# EAGLE design Postmaster (EAGLE 6.3)
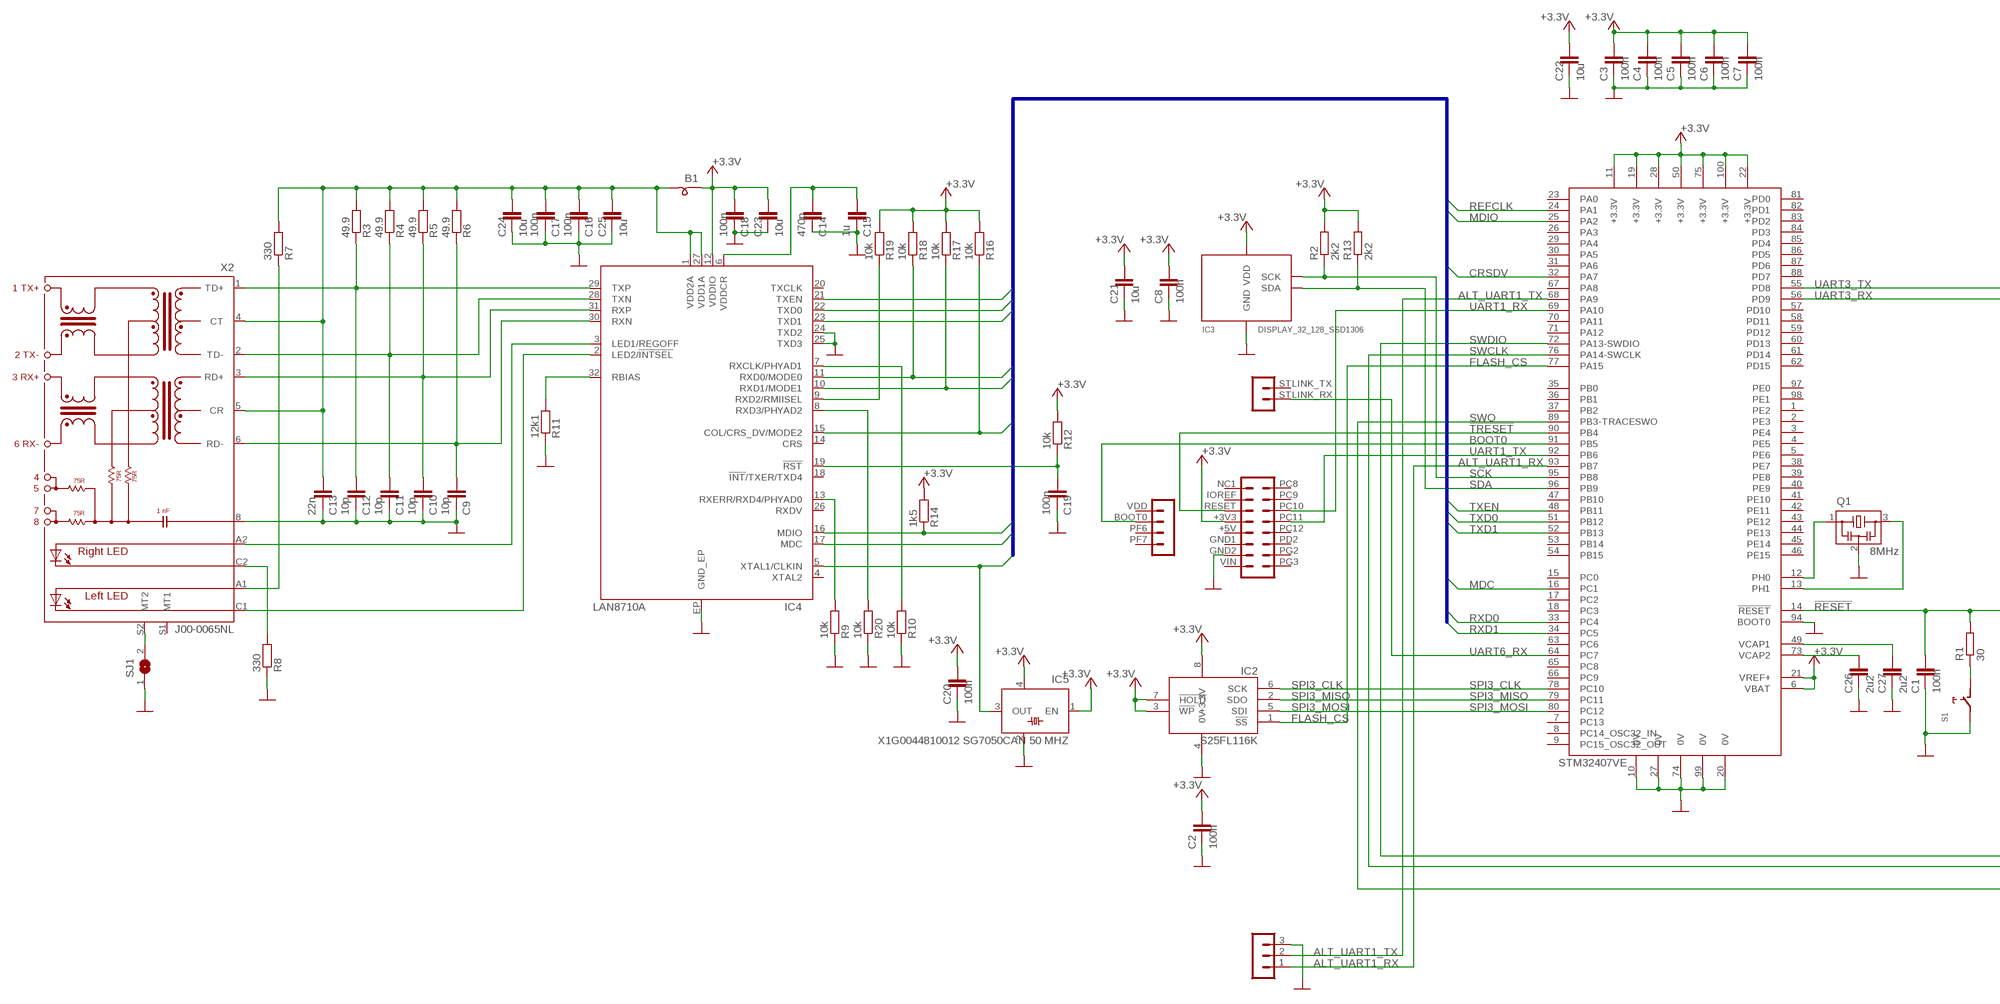
[diagram p0: schematic, sheet 1, part 1 of 2]
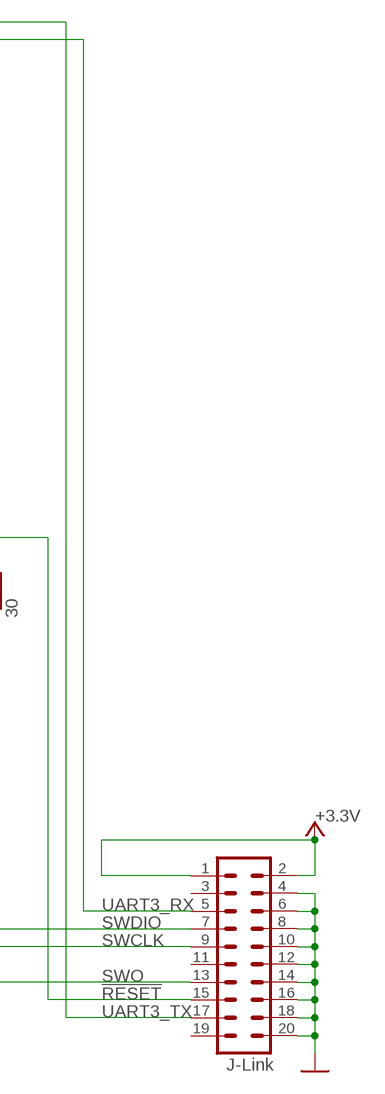
[diagram p1: schematic, sheet 1, part 2 of 2]

## Parts
B1  BEADSMD  [0805]
C1  100n  CAPACITOR0805  [0805]
C2  100n  CAPACITOR0805  [0805]
C3  100n  CAPACITOR0805  [0805]
C4  100n  CAPACITOR0805  [0805]
C5  100n  CAPACITOR0805  [0805]
C6  100n  CAPACITOR0805  [0805]
C7  100n  CAPACITOR0805  [0805]
C8  100n  CAPACITOR0805  [0805]
C9  10p  CAPACITOR0805  [0805]
C10  10p  CAPACITOR0805  [0805]
C11  10p  CAPACITOR0805  [0805]
C12  10p  CAPACITOR0805  [0805]
C13  22n  CAPACITOR0805  [0805]
C14  470p  CAPACITOR0805  [0805]
C15  1u  CAPACITOR0805  [0805]
C16  100n  CAPACITOR0805  [0805]
C17  100n  CAPACITOR0805  [0805]
C18  100n  CAPACITOR0805  [0805]
C19  100n  CAPACITOR0805  [0805]
C20  100n  CAPACITOR0805  [0805]
C21  10u  CAPACITOR0805  [0805]
C22  10u  CAPACITOR0805  [0805]
C23  10u  CAPACITOR0805  [0805]
C24  10u  CAPACITOR0805  [0805]
C25  10u  CAPACITOR0805  [0805]
C26  2u2  CAPACITOR0805  [0805]
C27  2u2  CAPACITOR0805  [0805]
IC1  STM32F407  [TQFP100]
IC2  S25FL116K  S25FL116KW  [SOIC8-WIDE]
IC3  DISPLAY_32_128_SSD1306  [DISPLAY_128_32_SSD1306]
IC4  LAN8710A  [QFN32]
IC5  X1G0044810012 SG7050CAN 50 MHZ  SM77H  [SM77H]
Q1  8MHz  RESONATOR-S  [RESONATOR-SMALL]
R1  30  RESISTORR0805  [0805]
R2  2k2  RESISTORR0805  [0805]
R3  49.9  RESISTORR0805  [0805]
R4  49.9  RESISTORR0805  [0805]
R5  49.9  RESISTORR0805  [0805]
R6  49.9  RESISTORR0805  [0805]
R7  330  RESISTORR0805  [0805]
R8  330  RESISTORR0805  [0805]
R9  10k  RESISTORR0805  [0805]
R10  10k  RESISTORR0805  [0805]
R11  12k1  RESISTORR0805  [0805]
R12  10k  RESISTORR0805  [0805]
R13  2k2  RESISTORR0805  [0805]
R14  1k5  RESISTORR0805  [0805]
R16  10k  RESISTORR0805  [0805]
R17  10k  RESISTORR0805  [0805]
R18  10k  RESISTORR0805  [0805]
R19  10k  RESISTORR0805  [0805]
R20  10k  RESISTORR0805  [0805]
S1  SWITCHSMD  [SWITCH-SMD]
SJ1  SJ  [SJ]
U$1  NUCLEO-TOPLEFT  [NUCLEO-TOPLEFT]
U$3  HEADER-MALE-3  [HEADER-MALE-3]
X1  HEADER-IDC-10-2  [IDC-10_2]
X2  J00-0065NL  [ETHERNET]

## Nets
0V: C1.2 C2.2 C3.2 C4.2 C5.2 C6.2 C7.2 C8.2 C9.2 C10.2 C11.2 C12.2 C13.2 C14.2 C15.2 C16.2 C17.2 C18.2 C19.2 C20.2 C21.2 C22.2 C23.2 C24.2 C25.2 C26.2 C27.2 IC1.10(0V) IC1.20(0V) IC1.27(0V) IC1.74(0V) IC1.94(BOOT0) IC1.99(0V) IC2.4(0V) IC3.GND IC4.24(TXD2) IC4.25(TXD3) IC4.EP(GND_EP) IC5.2(0V) Q1.2 R8.1 R9.1 R10.1 R11.1 R20.1 S1.3 S1.4 SJ1.1 U$1.GND2 U$3.3 X1.4 X1.6 X1.8 X1.10 X1.12 X1.14 X1.16 X1.18 X1.20 X2.8
!RESET!: C1.1 IC1.14(!RESET!) R1.2 X1.15
!TRESET!: IC1.90(PB4) U$1.RESET
+3.3V: B1.1 C2.1 C3.1 C4.1 C5.1 C6.1 C7.1 C8.1 C18.1 C20.1 C21.1 C22.1 C23.1 IC1.6(VBAT) IC1.11(+3.3V) IC1.19(+3.3V) IC1.21(VREF+) IC1.22(+3.3V) IC1.28(+3.3V) IC1.50(+3.3V) IC1.75(+3.3V) IC1.100(+3.3V) IC2.3(!WP!) IC2.7(!HOLD!) IC2.8(+3.3V) IC3.VCC(VDD) IC4.12(VDDIO) IC5.1(EN) IC5.4(+3.3V) R2.2 R12.2 R13.2 R14.2 R16.2 R17.2 R18.2 R19.2 U$1.+3V3 X1.1 X1.2
ALT_UART1_RX: IC1.93(PB7) U$3.1
ALT_UART1_TX: IC1.68(PA9) U$3.2
BOOT0: IC1.91(PB5) U$1.BOOT0
CRSDV: IC1.32(PA7) IC4.15(COL/CRS_DV/MODE2) R16.1
FLASH_CS: IC1.77(PA15) IC2.1(!SS!)
MDC: IC1.16(PC1) IC4.17(MDC)
MDIO: IC1.25(PA2) IC4.16(MDIO) R14.1
N$1: C26.1 IC1.73(VCAP2)
N$2: R1.1 S1.1 S1.2
N$3: C27.1 IC1.49(VCAP1)
N$4: R7.1 X2.A1(A-L)
N$5: IC4.3(LED1/REGOFF) X2.A2(A-R)
N$6: R8.2 X2.C2(C-R)
N$8: IC1.12(PH0) Q1.1
N$9: IC1.13(PH1) Q1.3
N$21: C12.1 IC4.29(TXP) R3.1 X2.1(TD+)
N$22: C11.1 IC4.28(TXN) R4.1 X2.2(TD-)
N$23: C10.1 IC4.31(RXP) R5.1 X2.3(RD+)
N$24: C9.1 IC4.30(RXN) R6.1 X2.6(RD-)
N$27: IC4.2(LED2/!INTSEL!) X2.C1(C-L)
N$31: IC4.13(RXERR/RXD4/PHYAD0) R9.2
N$32: IC4.7(RXCLK/PHYAD1) R10.2
N$33: IC4.32(RBIAS) R11.2
N$34: C14.1 C15.1 IC4.6(VDDCR)
N$35: SJ1.2 X2.S2(MT2)
N$36: B1.2 C13.1 C16.1 C17.1 C24.1 C25.1 IC4.1(VDD2A) IC4.27(VDD1A) R3.2 R4.2 R5.2 R6.2 R7.2 X2.4(CT) X2.5(CR)
N$42: C19.1 IC4.19(!RST!) R12.1
N$45: IC4.8(RXD3/PHYAD2) R20.2
N$47: IC4.9(RXD2/RMIISEL) R19.1
REFCLK: IC1.24(PA1) IC4.5(XTAL1/CLKIN) IC5.3(OUT)
RXD0: IC1.33(PC4) IC4.11(RXD0/MODE0) R18.1
RXD1: IC1.34(PC5) IC4.10(RXD1/MODE1) R17.1
SCK: IC1.95(PB8) IC3.SCK R2.1
SDA: IC1.96(PB9) IC3.SDA R13.1
SPI3_CLK: IC1.78(PC10) IC2.6(SCK)
SPI3_MISO: IC1.79(PC11) IC2.2(SDO)
SPI3_MOSI: IC1.80(PC12) IC2.5(SDI)
SWCLK: IC1.76(PA14-SWCLK) X1.9
SWDIO: IC1.72(PA13-SWDIO) X1.7
SWO: IC1.89(PB3-TRACESWO) X1.13
TXD0: IC1.51(PB12) IC4.22(TXD0)
TXD1: IC1.52(PB13) IC4.23(TXD1)
TXEN: IC1.48(PB11) IC4.21(TXEN)
UART1_RX: IC1.69(PA10) U$1.PC10
UART1_TX: IC1.92(PB6) U$1.PC11
UART3_RX: IC1.56(PD9) X1.5
UART3_TX: IC1.55(PD8) X1.17
UART6_RX: IC1.64(PC7) U$1.STLINK_RX
Unconnected: IC1.1(PE2) IC1.2(PE3) IC1.3(PE4) IC1.4(PE5) IC1.5(PE6) IC1.7(PC13) IC1.8(PC14_OSC32_IN) IC1.9(PC15_OSC32_OUT) IC1.15(PC0) IC1.17(PC2) IC1.18(PC3) IC1.23(PA0) IC1.26(PA3) IC1.29(PA4) IC1.30(PA5) IC1.31(PA6) IC1.35(PB0) IC1.36(PB1) IC1.37(PB2) IC1.38(PE7) IC1.39(PE8) IC1.40(PE9) IC1.41(PE10) IC1.42(PE11) IC1.43(PE12) IC1.44(PE13) IC1.45(PE14) IC1.46(PE15) IC1.47(PB10) IC1.53(PB14) IC1.54(PB15) IC1.57(PD10) IC1.58(PD11) IC1.59(PD12) IC1.60(PD13) IC1.61(PD14) IC1.62(PD15) IC1.63(PC6) IC1.65(PC8) IC1.66(PC9) IC1.67(PA8) IC1.70(PA11) IC1.71(PA12) IC1.81(PD0) IC1.82(PD1) IC1.83(PD2) IC1.84(PD3) IC1.85(PD4) IC1.86(PD5) IC1.87(PD6) IC1.88(PD7) IC1.97(PE0) IC1.98(PE1) IC4.4(XTAL2) IC4.14(CRS) IC4.18(!INT!/TXER/TXD4) IC4.20(TXCLK) IC4.26(RXDV) U$1.+5V U$1.GND1 U$1.IOREF U$1.NC1 U$1.PC8 U$1.PC9 U$1.PC12 U$1.PD2 U$1.PF6 U$1.PF7 U$1.PG2 U$1.PG3 U$1.STLINK_TX U$1.VDD U$1.VIN X1.3 X1.11 X1.19 X2.S1(MT1)

## Buses
MDIO,MDC,REFCLK,CRSDV,RXD0,RXD1,TXEN,TXD0,TXD1

## Notes on the sheet
- STM32407VE
- J-Link

## Library data of the parts
B1 = passive:BEAD
C1-C27 = passive:CAPACITOR
IC1 = ic:STM32F407
IC2 = ic:S25FL116K
IC3 = ic:DISPLAY_32_128_SSD1306
IC4 = ic:LAN8710A
IC5 = ic:SM77H: 3.3V CMOS Clock Oscillator Source: www.pletronics.com .. sm77h%203.3v.pdf
Q1 = passive:RESONATOR
R1-R14 R16-R20 = passive:RESISTOR
S1 = passive:SWITCH
SJ1 = jumper:SJ: SMD solder JUMPER
U$1 = header:NUCLEO-TOPLEFT
U$3 = header:HEADER-MALE-3
X1 = header:HEADER-IDC-10-2
X2 = header:J00-0065NL

## Board
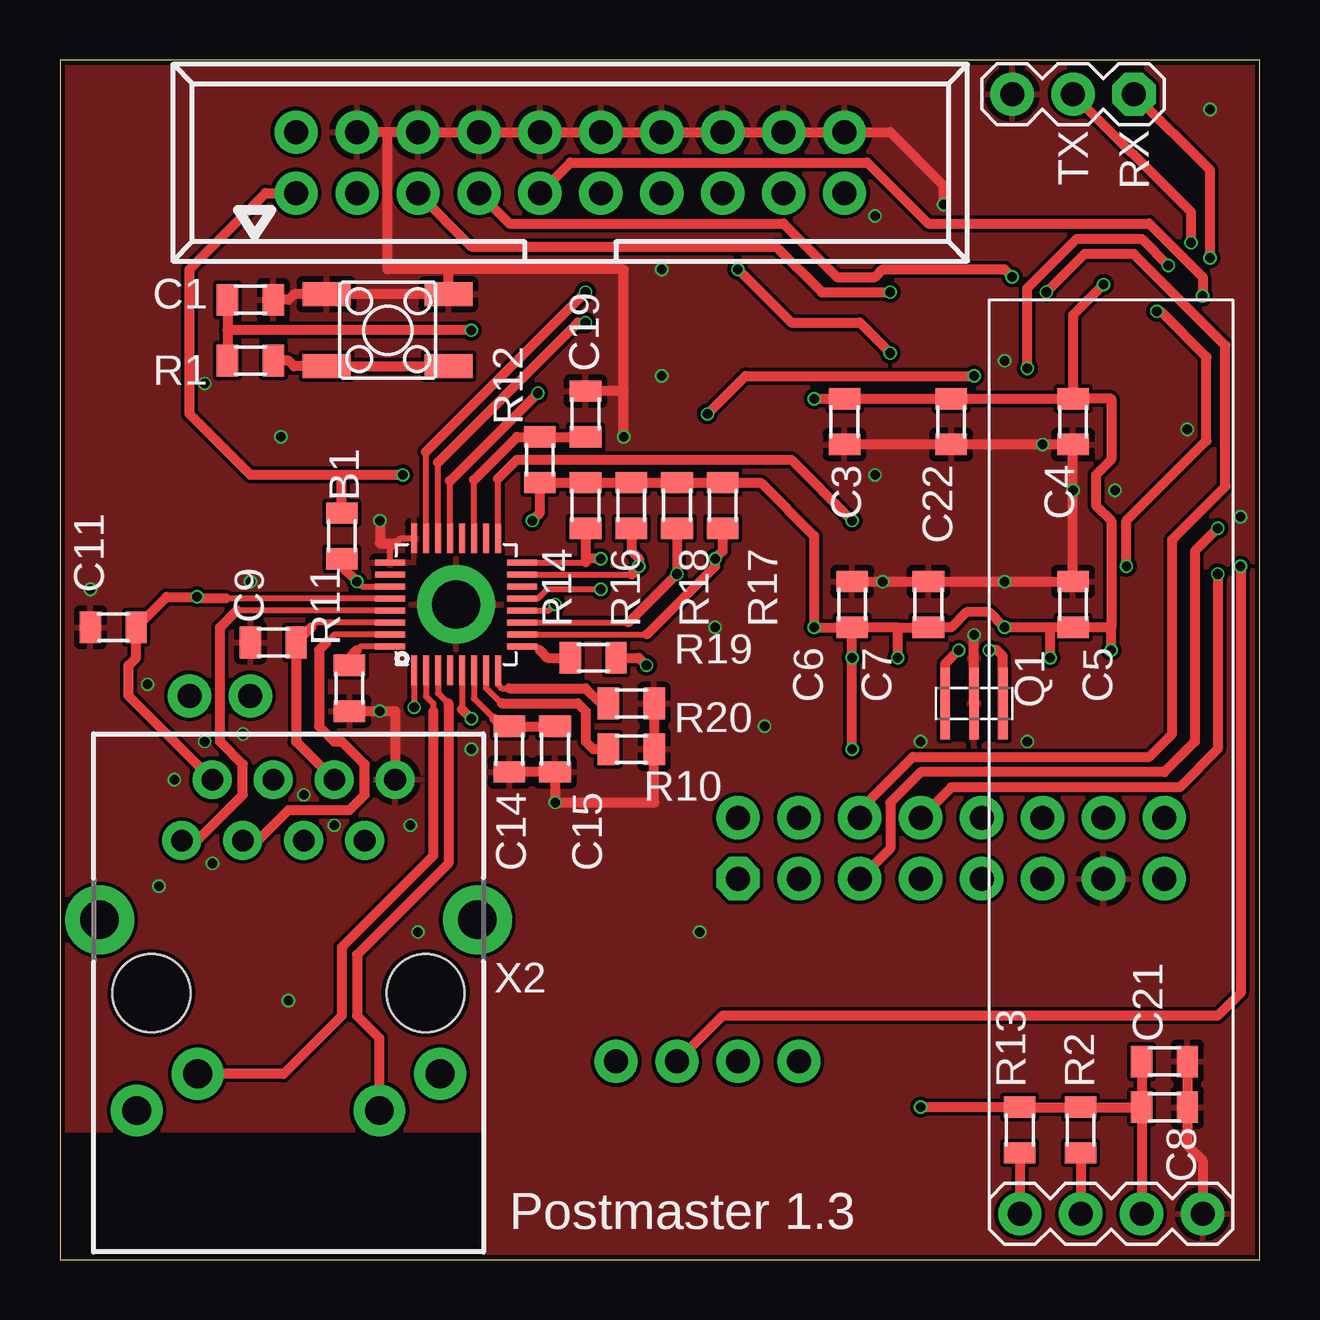
[diagram p2: board, top side]
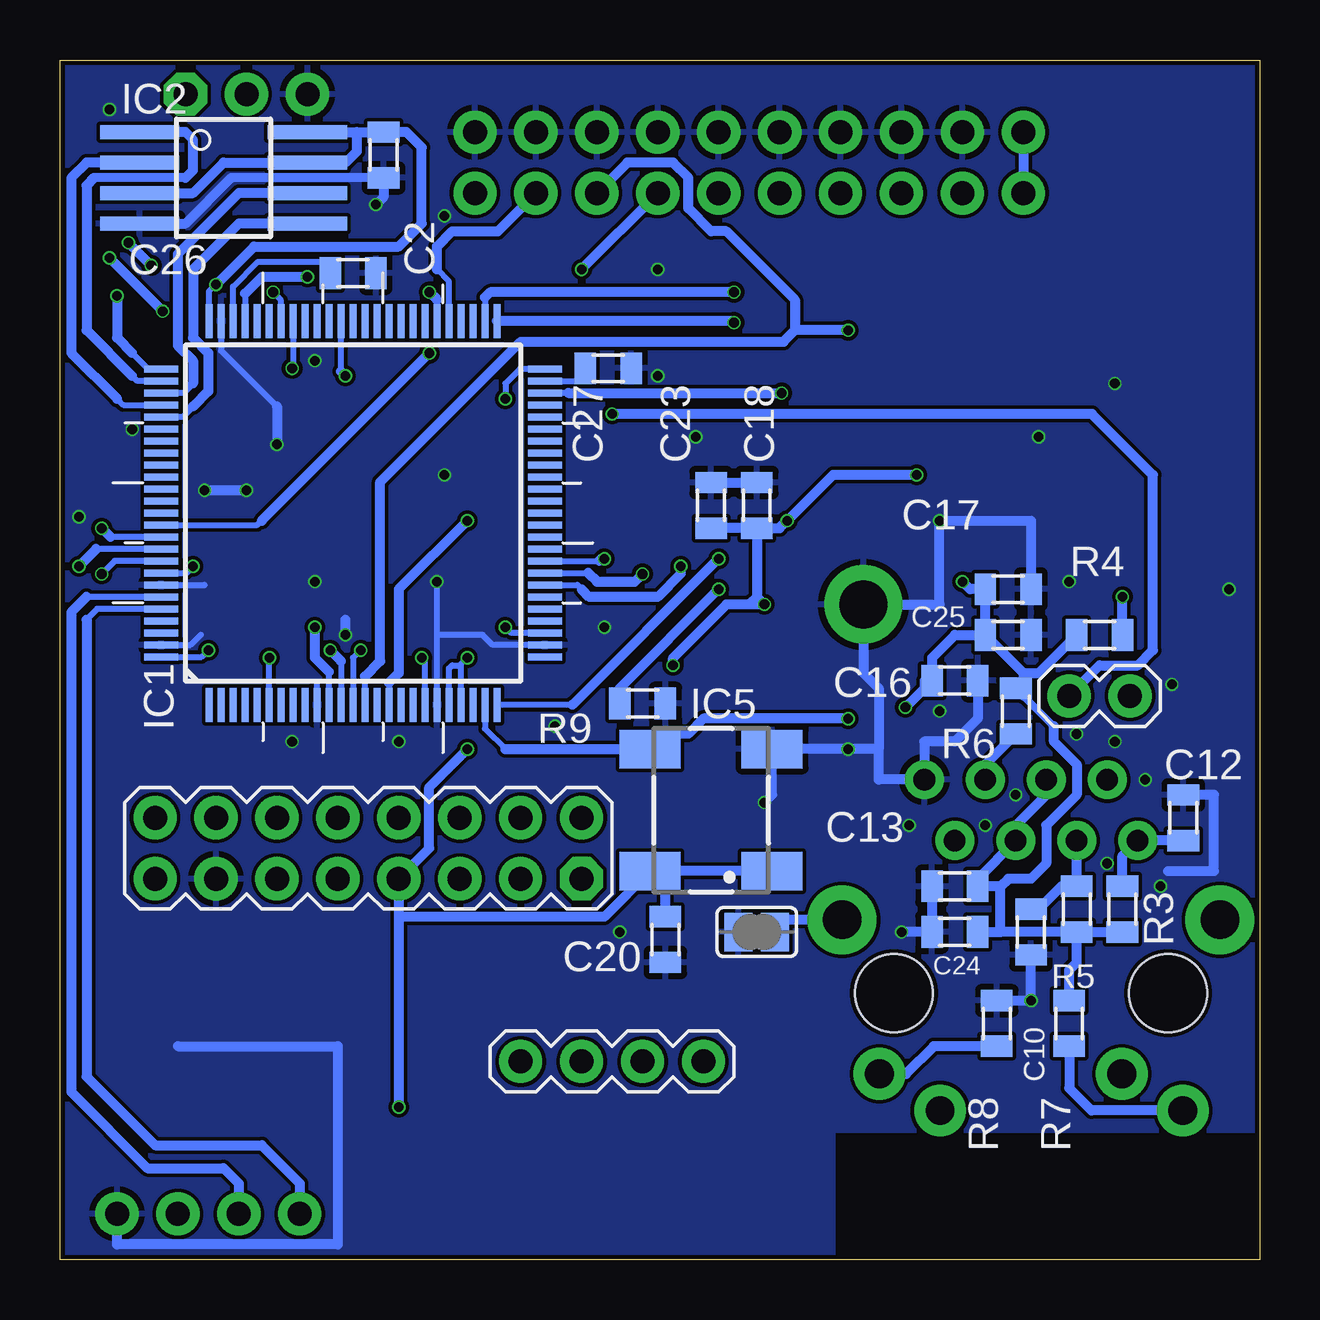
[diagram p3: board, bottom side, seen from below]

Size 50 x 50 mm. Coordinates in mm from the lower left corner, seen from the top.
Outline: 0,0 50,0 50,50 0,50 0,0
Copper layers (1*16): Top 0.035mm / dielectric 1.6mm / Bottom 0.035mm
Design rules "Jlcpcb *": minimum track width 10mil, minimum drill 0.3mm, track to track 6mil, track to pad 6mil, pad to pad 6mil, via to via 6mil, smd to smd 6mil, copper to edge 0.2mm, drill to drill 6mil, minimum pad ring 10mil, minimum via ring 3mil, stop-mask expansion 4mil, vias tented up to drill 0mil, thermal gap 10mil
tRestrict: area 37.1,21.6 to 37.8,24.8; area 38.4,21.6 to 39.1,24.8

### Footprints (pad centres in the part's own frame; a part is rotated, then mirrored left to right if it is on the bottom)
0805 = smd 0.889 x 1.321: 1 -0.635,0; 2 1.27,0
TQFP100 = smd 1.4 x 0.28: 1 -8,6; 2 -8,5.5; 3 -8,5; 4 -8,4.5; 5 -8,4; 6 -8,3.5; 7 -8,3; 8 -8,2.5; 9 -8,2; 10 -8,1.5; 11 -8,1; 12 -8,0.5; 13 -8,0; 14 -8,-0.5; 15 -8,-1; 16 -8,-1.5; 17 -8,-2; 18 -8,-2.5; 19 -8,-3; 20 -8,-3.5; 21 -8,-4; 22 -8,-4.5; 23 -8,-5; 24 -8,-5.5; 25 -8,-6; 51 8,-6; 52 8,-5.5; 53 8,-5; 54 8,-4.5; 55 8,-4; 56 8,-3.5; 57 8,-3; 58 8,-2.5; 59 8,-2; 60 8,-1.5; 61 8,-1; 62 8,-0.5; 63 8,0; 64 8,0.5; 65 8,1; 66 8,1.5; 67 8,2; 68 8,2.5; 69 8,3; 70 8,3.5; 71 8,4; 72 8,4.5; 73 8,5; 74 8,5.5; 75 8,6 | smd 0.28 x 1.4: 26 -6,-8; 27 -5.5,-8; 28 -5,-8; 29 -4.5,-8; 30 -4,-8; 31 -3.5,-8; 32 -3,-8; 33 -2.5,-8; 34 -2,-8; 35 -1.5,-8; 36 -1,-8; 37 -0.5,-8; 38 0,-8; 39 0.5,-8; 40 1,-8; 41 1.5,-8; 42 2,-8; 43 2.5,-8; 44 3,-8; 45 3.5,-8; 46 4,-8; 47 4.5,-8; 48 5,-8; 49 5.5,-8; 50 6,-8; 76 6,8; 77 5.5,8; 78 5,8; 79 4.5,8; 80 4,8; 81 3.5,8; 82 3,8; 83 2.5,8; 84 2,8; 85 1.5,8; 86 1,8; 87 0.5,8; 88 0,8; 89 -0.5,8; 90 -1,8; 91 -1.5,8; 92 -2,8; 93 -2.5,8; 94 -3,8; 95 -3.5,8; 96 -4,8; 97 -4.5,8; 98 -5,8; 99 -5.5,8; 100 -6,8
SOIC8-WIDE = smd 0.584 x 3.302: 1 -1.905,-3.493; 2 -0.635,-3.493; 3 0.635,-3.493; 4 1.905,-3.493; 5 1.905,3.493; 6 0.635,3.493; 7 -0.635,3.493; 8 -1.905,3.493
DISPLAY_128_32_SSD1306 = drill 1: GND 3.81,0; SCK -1.27,0; SDA -3.81,0; VCC 1.27,0
QFN32 = smd 0.26 x 1.23: 1 -1.75,-2.75; 2 -1.25,-2.75; 3 -0.75,-2.75; 4 -0.25,-2.75; 5 0.25,-2.75; 6 0.75,-2.75; 7 1.25,-2.75; 8 1.75,-2.75; 17 1.75,2.75; 18 1.25,2.75; 19 0.75,2.75; 20 0.25,2.75; 21 -0.25,2.75; 22 -0.75,2.75; 23 -1.25,2.75; 24 -1.75,2.75 | smd 1.23 x 0.26: 9 2.75,-1.75; 10 2.75,-1.25; 11 2.75,-0.75; 12 2.75,-0.25; 13 2.75,0.25; 14 2.75,0.75; 15 2.75,1.25; 16 2.75,1.75; 25 -2.75,1.75; 26 -2.75,1.25; 27 -2.75,0.75; 28 -2.75,0.25; 29 -2.75,-0.25; 30 -2.75,-0.75; 31 -2.75,-1.25; 32 -2.75,-1.75 | drill 2: EP 0,0
SM77H = smd 1.6 x 2.54: 1 -2.54,-2.54; 2 2.54,-2.54; 3 2.54,2.54; 4 -2.54,2.54
RESONATOR-SMALL = smd 0.4 x 3: 1 -1.2,0; 2 0,0; 3 1.2,0
SWITCH-SMD = smd 1 x 2: 1 -1.5,2.54; 2 -1.5,-2.54; 3 1.5,2.54; 4 1.5,-2.54
SJ = smd 1.168 x 1.6: 1 -0.762,0; 2 0.762,0
NUCLEO-TOPLEFT = drill 1: +3V3 2.54,0; +5V 2.54,-2.54; BOOT0 10.16,10.16; GND1 2.54,-5.08; GND2 2.54,-7.62; IOREF 2.54,5.08; PC8 0,7.62; PC9 0,5.08; PC10 0,2.54; PC11 0,0; PC12 0,-2.54; PD2 0,-5.08; PF6 10.16,7.62; PF7 10.16,5.08; PG2 0,-7.62; PG3 0,-10.16; RESET 2.54,2.54; STLINK_RX -5.08,27.94; STLINK_TX -5.08,30.48; VDD 10.16,12.7; VIN 2.54,-10.16 | drill 1 octagon: NC1 2.54,7.62
HEADER-MALE-3 = drill 1 octagon: 1 -3.81,0 | drill 1: 2 -1.27,0; 3 1.27,0
IDC-10_2 = drill 1: 1 -11.43,-1.27; 2 -11.43,1.27; 3 -8.89,-1.27; 4 -8.89,1.27; 5 -6.35,-1.27; 6 -6.35,1.27; 7 -3.81,-1.27; 8 -3.81,1.27; 9 -1.27,-1.27; 10 -1.27,1.27; 11 1.27,-1.27; 12 1.27,1.27; 13 3.81,-1.27; 14 3.81,1.27; 15 6.35,-1.27; 16 6.35,1.27; 17 8.89,-1.27; 18 8.89,1.27; 19 11.43,-1.27; 20 11.43,1.27
ETHERNET = drill 0.9: 1 4.445,-6.35; 2 3.175,-8.89; 3 1.905,-6.35; 4 0.635,-8.89; 5 -0.635,-6.35; 6 -1.905,-8.89; 7 -3.175,-6.35; 8 -4.445,-8.89 | drill 1.2: A1 6.325,4.902; A2 -3.785,4.902; C1 3.785,3.378; C2 -6.325,3.378 | drill 1.6: S1 7.874,-3.05; S2 -7.874,-3.05 | hole 3.25: 5.715,0; -5.715,0

### Placement (x,y rotation side)
B1  11.75,30.48 270 top
C1  7.62,40.01 0 top
C2  36.51,46.35 270 bottom
C3  32.7,35.24 270 top
C4  42.23,35.24 270 top
C5  42.23,26.99 90 top
C6  33.02,26.99 90 top
C7  36.2,26.99 90 top
C8  45.72,6.35 0 top
C9  9.21,25.72 180 top
C10  9.53,13.97 270 bottom
C11  2.54,26.35 180 top
C12  3.17,18.1 90 bottom
C13  12.38,15.56 180 bottom
C14  18.73,21.59 270 top
C15  20.64,21.59 270 top
C16  13.02,24.13 0 bottom
C17  10.79,27.94 0 bottom
C18  20.95,31.11 90 bottom
C19  21.91,34.92 90 top
C20  24.77,13.65 270 bottom
C21  45.72,8.26 0 top
C22  37.15,35.24 270 top
C23  22.86,31.11 90 bottom
C24  12.38,13.65 180 bottom
C25  10.79,26.04 0 bottom
C26  38.1,41.12 0 bottom
C27  27.46,37.15 0 bottom
IC1  37.78,31.11 90 bottom
IC2  43.18,45.09 270 bottom
IC3  43.81,1.91 0 top
IC4  16.51,27.3 0 top
IC5  22.86,18.73 90 bottom
Q1  38.1,23.18 180 top
R1  8.26,37.47 180 top
R2  42.55,5.08 90 top
R3  5.71,14.92 270 bottom
R4  6.35,26.04 180 bottom
R5  7.62,14.92 270 bottom
R6  10.16,22.54 90 bottom
R7  7.94,9.53 90 bottom
R8  10.95,10.16 270 bottom
R9  25.4,23.18 180 bottom
R10  24.13,21.27 180 top
R11  12.06,23.5 90 top
R12  20,33.66 270 top
R13  40.01,5.08 90 top
R14  21.91,31.11 90 top
R16  23.81,31.11 90 top
R17  27.62,31.11 90 top
R18  25.72,31.11 90 top
R19  21.91,25.08 0 top
R20  24.13,23.18 180 top
S1  13.65,38.73 90 top
SJ1  20.95,13.65 0 bottom
U$1  35.88,18.41 270 bottom
U$3  40.96,48.58 180 top
X1  21.27,45.72 0 top
X2  9.53,11.11 180 top

### Tracks (layer width: path | path; a pad name or v marks a point on that pad's centre or on a via)
0V  (via drill 0.4)
  Top 0.254: IC4.25 13.76,29.64 13.97,29.84 14.18,30.05 IC4.24
  Top 0.406: C14.2 C15.2 v20.64,19.05 24.77,19.05 R10.1 R20.1 | 13.97,29.84 13.34,29.84 v13.34,30.8 | 23.5,36.2 C19.2 | 13.65,46.99 X1.6 X1.8 X1.10 X1.12 X1.14 X1.16 X1.18 X1.20 34.61,46.99 36.83,44.77 v36.83,43.97 | 13.65,46.99 X1.4 | C6.2 v34.29,28.26 C7.2 v39.37,28.26 C5.2 C4.2 v40.96,33.97 C22.2 C3.2 | v23.5,34.29 23.5,36.2 | IC3.GND 47.62,4.13 46.99,4.76 C8.2 C21.2 | 23.5,36.2 23.5,41.27 16.19,41.27 | 16.19,41.27 13.65,41.27 13.65,46.99 | R11.1 v13.34,22.86 13.97,22.86 X2.8 | C1.2 9.53,40.01 9.76,40.23 S1.3 S1.4 16.19,41.27 | Q1.2 v38.1,26.04
  Bottom 0.254: IC1.20 34.28,26.04 | 34.28,26.04 v34.28,28.25 v34.29,28.26 | IC1.10 39.28,24.04 | IC1.99 44.55,25.61 44.13,26.04 | IC1.27 31.96,25.61 32.38,26.04 34.28,26.04 | IC1.74 43.28,37.88 40.96,35.56 | IC1.94 43.97,28.11 43.97,28.1
  Bottom 0.381: C2.2 42.86,45.09
  Bottom 0.406: 15.88,21.27 IC5.2 20.32,19.37 v20.64,19.05 | 3.81,16.19 1.91,16.19 1.91,19.37 C12.2 | C17.2 9.53,30.8 v13.34,30.8 13.34,27.3 IC4.EP 16.51,24.45 15.88,23.81 15.88,21.27 | 15.88,21.27 15.88,20 X2.8 13.97,21.59 12.7,21.59 11.75,22.54 C16.2 | 40.96,35.56 v40.96,33.97 | 45.09,8.89 38.42,8.89 38.42,0.64 47.62,0.64 IC3.GND | C2.2 36.51,44.29 v36.83,43.97 | IC2.4 44.77,43.18 42.86,45.09 | C23.2 C18.2 | v14.92,13.65 C24.2 C13.2 | v38.1,26.04 38.1,26.67 | R8.1 v9.53,10.79 C10.2 | v43.97,32.07 v42.23,32.07
  other vias: 6.03,36.51 33.97,32.7 27.3,26.35 26.67,13.65 49.21,30.96 47.94,47.94 4.76,20 14.61,18.1 4.13,15.56 25.08,41.27 33.97,43.5 9.21,34.29 25.08,36.83 7.62,21.91 3.65,23.97 10.16,19.37 6.35,16.51 7.94,28.26 17.14,21.27 11.43,18.1 6.03,21.59 1.27,27.94 40.32,21.59 35.88,21.59 39.37,37.47 29.37,22.23 46.99,34.61
  pour Bottom: 0,5.4 0,49.85 49.85,49.85 49.85,0 17.78,0 17.78,5.4
  pour Top: 0,5.4 0,49.85 49.85,49.85 49.85,0 17.78,0 17.78,5.4
!RESET!  (via drill 0.4)
  Top 0.406: C1.1 6.99,38.73 | 6.99,38.73 R1.2 | v17.14,38.73 6.99,38.73
  Bottom 0.254: IC1.14 37.28,24.31
  Bottom 0.406: X1.15 26.35,45.72 24.45,45.72 23.81,45.09 23.81,43.81 22.86,42.86 22.23,42.86 19.37,40.01 19.37,38.73 | 37.28,24.31 36.65,24.95 36.65,32.41 30.8,38.26 19.84,38.26 19.37,38.73 | v17.14,38.73 19.37,38.73
!TRESET!  (via drill 0.4)
  Top 0.406: v48.26,30.48 47.31,29.53 47.31,21.59 46.04,20.32 35.88,20.32 34.61,19.05 34.61,17.14 U$1.RESET
  Bottom 0.254: IC1.90 47.9,30.11
  Bottom 0.406: 47.9,30.11 v48.26,30.48
+3.3V  (via drill 0.4)
  Top 0.254: IC4.12 20.39,27.05 v20.64,27.3
  Top 0.406: R19.2 24.13,25.08 v24.45,24.77 | v19.68,30.8 20,31.11 R12.2 R14.2 R16.2 R18.2 R17.2 29.21,32.38 31.43,30.16 v31.43,26.35 C6.1 | v31.43,35.88 C3.1 C22.1 C4.1 | C6.1 v33.02,25.08 v33.02,21.27 | v34.92,25.08 34.92,26.35 | 34.92,26.35 C6.1 | 34.92,26.35 C7.1 37.15,26.35 37.78,26.99 38.73,26.99 v39.37,26.35 41.27,26.35 | 41.27,26.35 C5.1 43.81,26.35 | v43.81,25.4 43.81,26.35 | C4.1 43.81,35.88 43.81,33.34 43.18,32.7 43.18,31.43 43.81,30.8 43.81,26.35 | v43.5,40.64 42.23,39.37 C4.1 | C8.1 IC3.VCC | C8.1 R2.2 R13.2 v35.88,6.35 | X1.1 8.57,44.45 5.4,41.27 5.4,35.24 7.94,32.7 11.75,32.7 | v41.27,25.08 41.27,26.35 | C21.1 C8.1 | v14.29,32.7 11.75,32.7 | B1.1 11.75,32.7
  Bottom 0.254: IC1.22 33.28,24.82 v33.02,25.08 33.34,24.77 33.66,24.77 33.78,24.64 IC1.21 | IC1.100 44.1,25.11 v43.81,25.4 | IC1.28 31.2,26.11 v31.43,26.35 | IC1.50 30.83,37.12 31.43,36.51 v31.43,35.88 | IC1.19 34.78,24.94 v34.92,25.08 | IC1.75 43.78,40.35 v43.5,40.64 | IC1.6 41.28,25.07 v41.27,25.08 | IC1.11 38.78,24.5
  Bottom 0.406: IC5.1 24.77,16.19 | 24.77,16.19 IC5.4 27.3,14.29 35.88,14.29 | v24.45,24.77 24.45,25.08 22.23,27.3 21.27,27.3 | C18.1 20.95,27.62 | v14.29,32.7 17.78,32.7 v19.68,30.8 20,30.48 C18.1 | v43.5,40.64 41.91,42.23 35.88,42.23 34.92,43.18 34.92,46.35 35.56,46.99 C2.1 | 35.88,14.29 U$1.+3V3 34.61,17.14 34.61,19.68 v33.02,21.27 | 35.88,14.29 v35.88,6.35 | X1.2 X1.1 | C2.1 36.83,46.99 | IC2.3 44.45,44.45 43.18,45.72 IC2.7 38.1,45.72 37.62,46.2 37.62,46.99 | IC2.8 37.62,46.99 | 37.62,46.99 C2.1 | C18.1 C23.1 | 21.27,27.3 v20.64,27.3 20.95,27.62 | 20.95,27.62 21.27,27.3 | C20.1 24.77,16.19 | 38.78,24.5 39.37,25.08 v39.37,26.35
ALT_UART1_RX  (via drill 0.4)
  Top 0.406: v44.45,28.89 44.45,30.8 47.78,34.13 47.78,37.62 45.88,39.53 v45.72,39.53 | v47.94,41.75 47.94,45.4 U$3.1
  Bottom 0.254: IC1.93 44.73,28.61 v44.45,28.89
  Bottom 0.406: v45.72,39.53 v47.94,41.75
ALT_UART1_TX  (via drill 0.4)
  Top 0.406: v40.32,37.15 40.32,40.48 42.39,42.55 45.09,42.55 v46.2,41.43 | v47.15,42.39 47.15,43.66 U$3.2
  Bottom 0.254: IC1.68 40.28,37.19 v40.32,37.15
  Bottom 0.406: v46.2,41.43 v47.15,42.39
BOOT0  (via drill 0.4)
  Top 0.406: v49.21,28.89 49.21,11.11 48.26,10.16 27.62,10.16 U$1.BOOT0
  Bottom 0.254: IC1.91 48.49,29.61
  Bottom 0.406: 48.49,29.61 v49.21,28.89
CRSDV  (via drill 0.4)
  Top 0.254: IC4.15 23.83,28.55
  Top 0.406: R16.1 23.81,29.53 24.13,29.21 v24.13,28.89 24.13,28.85 23.83,28.55
  Bottom 0.254: IC1.32 28.43,28.11 28.26,27.94
  Bottom 0.406: v24.13,28.89 24.13,28.57 25.08,27.62 27.94,27.62 28.26,27.94
FLASH_CS
  Bottom 0.254: IC1.77 46.77,36.62 46.99,36.83
  Bottom 0.381: 44.77,45.09 48.58,45.09
  Bottom 0.406: 46.35,46.99 IC2.1 44.77,46.99 44.45,46.67 44.45,45.4 44.77,45.09 | 48.58,45.09 48.9,44.77 48.9,38.73 46.99,36.83
MDC  (via drill 0.4)
  Top 0.254: IC4.17 18.26,32.55
  Top 0.406: 18.26,32.55 19.05,33.34 30.48,33.34 v33.02,30.8
  Bottom 0.254: 36.28,24.04 IC1.16
  Bottom 0.406: v33.02,30.8 35.88,27.94 35.88,24.45 36.28,24.04
MDIO  (via drill 0.4)
  Top 0.254: IC4.16 21.91,29.05
  Top 0.406: R14.1 21.91,29.21 | 21.91,29.21 21.91,29.05 | v22.54,29.21 21.91,29.21
  Bottom 0.254: 28.64,23.11 IC1.25
  Bottom 0.406: v22.54,29.21 28.64,23.11
N$1
  Bottom 0.254: IC1.73 42.78,40.56 41.75,41.59 38.89,41.59 38.89,41.27 C26.1
N$2
  Top 0.406: R1.1 9.53,37.47 9.76,37.23 S1.1 S1.2
N$3
  Bottom 0.254: IC1.49 28.1,36.62 C27.1
N$4
  Bottom 0.406: R7.1 7.94,7.14 7,6.21 X2.A1
N$5
  Top 0.254: IC4.3 15.76,23.61 16.19,23.18
  Top 0.406: 16.19,23.18 16.19,16.51 12.38,12.7 12.38,10.16 13.31,9.23 X2.A2
N$6
  Bottom 0.406: R8.2 13.58,8.89 14.74,7.73 X2.C2
N$8  (via drill 0.4)
  Top 0.406: Q1.1 39.3,25.15 39.05,25.4 v38.73,25.4
  Bottom 0.254: 38.28,24.95 IC1.12
  Bottom 0.406: v38.73,25.4 38.28,24.95
N$9  (via drill 0.4)
  Top 0.406: Q1.3 36.9,24.84 v37.47,25.4
  Bottom 0.254: v37.47,25.4 37.78,25.08 IC1.13
N$21
  Top 0.254: IC4.29 7.37,27.05
  Top 0.406: X2.1 5.71,17.46 7.62,19.37 7.62,20.64 6.67,21.59 6.67,26.35 7.37,27.05
  Bottom 0.406: C12.1 X2.1 5.71,16.83 R3.1
N$22  (via drill 0.4)
  Top 0.254: IC4.28 6.92,27.55
  Top 0.406: X2.2 3.17,23.18 2.86,23.5 2.86,24.77 3.17,25.08 C11.1 4.45,27.62 v5.71,27.62 5.78,27.55 6.92,27.55
  Bottom 0.406: R4.1 v5.71,27.62
N$23
  Top 0.254: IC4.31 11.45,26.05 11.11,25.72
  Top 0.406: X2.3 8.26,17.46 9.53,18.73 12.06,18.73 12.7,19.37 12.7,20.64 11.75,21.59 11.43,21.59 10.79,22.23 10.79,25.4 11.11,25.72
  Bottom 0.406: X2.3 R5.1 8.26,15.56 9.21,14.61 C10.1
N$24
  Top 0.254: IC4.30 10.68,26.55 10.48,26.35
  Top 0.406: 10.48,26.35 C9.1 9.84,21.59 X2.6
  Bottom 0.406: X2.6 11.43,20.64 R6.1
N$27
  Top 0.254: IC4.2 15.26,23.48 15.56,23.18 15.56,22.86
  Top 0.406: 15.56,22.86 15.56,16.83 11.75,13.02 11.75,10.16 9.32,7.73 X2.C1
N$31  (via drill 0.4)
  Top 0.254: IC4.13 19.93,27.55 20.32,27.94 v22.54,27.94
  Bottom 0.406: v22.54,27.94 26.67,23.81 R9.2
N$32
  Top 0.254: IC4.7 17.76,23.83 18.41,23.18
  Top 0.406: 18.41,23.18 21.59,23.18 21.91,22.86 21.91,21.59 22.23,21.27 R10.2
N$33
  Top 0.254: IC4.32 12.54,25.55 12.38,25.4
  Top 0.406: 12.38,25.4 12.06,25.08 R11.2
N$34
  Top 0.254: IC4.6 17.26,23.38 18.1,22.54
  Top 0.406: C15.1 C14.1 18.41,22.23 18.1,22.54
N$35
  Bottom 0.406: X2.S2 19.68,14.16 SJ1.2
N$36  (via drill 0.4)
  Top 0.254: v12.38,28.26 12.59,28.05 IC4.27 | IC4.1 v14.76,23.02
  Top 0.406: v12.38,28.26 11.75,28.89 B1.2
  Bottom 0.305: 8.57,22.23 9.84,23.5
  Bottom 0.406: X2.4 8.89,19.37 10.16,18.1 X2.5 11.75,15.88 C13.1 10.79,15.56 | R5.2 R3.2 | v12.38,28.26 12.06,27.94 C17.1 C25.1 | v14.76,23.02 13.96,23.81 13.96,24.13 C16.1 13.65,25.08 12.7,26.04 C25.1 | R5.2 10.79,13.65 | 10.79,13.65 10.79,15.56 | 10.79,15.56 10.48,15.88 9.53,15.88 8.89,16.51 8.89,18.1 7.62,19.37 7.62,20.64 8.57,21.59 8.57,22.23 | C24.1 10.79,13.65 | C25.1 9.84,24.45 | 9.84,24.45 9.21,24.45 R4.2 | 9.84,24.45 9.84,24.13 R6.2 9.84,23.5 | R7.2 7.94,12.06 7.62,12.38 R5.2
N$42
  Top 0.254: IC4.19 17.26,32.5
  Top 0.406: 17.26,32.5 19.05,34.29 R12.1 C19.1
N$45
  Top 0.254: IC4.8 18.26,23.97 18.41,23.81 18.73,23.81
  Top 0.406: 18.73,23.81 21.91,23.81 22.54,23.18 R20.2
N$47
  Top 0.254: IC4.9 19.85,25.55 20,25.4
  Top 0.406: 20,25.4 20.32,25.08 R19.1
REFCLK  (via drill 0.4)
  Top 0.254: IC4.5 16.76,22.93
  Top 0.406: 16.76,22.93 v17.14,22.54
  Bottom 0.254: 24.45,21.91 24.77,21.91 IC5.3 | IC1.24 32.28,22.12 31.43,21.27
  Bottom 0.406: v17.14,22.54 23.18,22.54 23.81,21.91 24.45,21.91 | 31.43,21.27 IC5.3
RXD0  (via drill 0.4)
  Top 0.254: IC4.11 23.7,26.55
  Top 0.406: 23.7,26.55 v25.72,28.57 R18.1
  Bottom 0.254: IC1.33 27.98,28.61
  Bottom 0.406: 27.98,28.61 27.62,28.26 26.04,28.26 v25.72,28.57
RXD1  (via drill 0.4)
  Top 0.254: IC4.10 24.47,26.05
  Top 0.406: 24.47,26.05 27.3,28.89 v27.3,29.21 27.62,29.53 R17.1
  Bottom 0.254: IC1.34 27.53,29.11
  Bottom 0.406: v27.3,29.21 27.43,29.21 27.53,29.11
SCK
  Top 0.406: R2.1 IC3.SCK
  Bottom 0.254: IC1.95 48.9,27.61
  Bottom 0.406: 48.9,27.61 49.53,26.99 49.53,6.99 46.35,3.81 43.18,3.81 42.55,3.17 IC3.SCK
SDA
  Top 0.406: R13.1 IC3.SDA
  Bottom 0.254: IC1.96 48.45,27.11 48.9,26.67
  Bottom 0.406: 48.9,26.67 48.9,7.62 46.04,4.76 41.59,4.76 40.01,3.17 IC3.SDA
SPI3_CLK
  Bottom 0.254: 44.45,36.51 44.85,36.12 IC1.78
  Bottom 0.406: IC2.6 42.55,44.45 45.09,41.91 45.09,38.1 44.45,37.47 44.45,36.51
SPI3_MISO
  Bottom 0.254: 47.62,35.88 47.36,35.62 IC1.79
  Bottom 0.406: IC2.2 48.9,45.72 49.53,45.09 49.53,37.78 47.62,35.88
SPI3_MOSI
  Bottom 0.254: 44.45,35.56 44.9,35.12 IC1.80
  Bottom 0.406: IC2.5 42.55,43.18 44.45,41.27 44.45,38.42 43.81,37.78 43.81,36.2 44.45,35.56
SWCLK  (via drill 0.4)
  Top 0.406: X1.9 21.27,45.72 33.66,45.72 36.2,43.18 45.4,43.18 47.62,40.96 v47.62,40.16
  Bottom 0.254: 46.99,37.78 46.32,37.12 IC1.76
  Bottom 0.406: v47.62,40.16 47.62,38.42 46.99,37.78
SWDIO  (via drill 0.4)
  Top 0.406: X1.7 18.73,43.18 30.16,43.18 32.38,40.96 33.97,40.96 34.29,41.27 39.37,41.27 v39.69,40.96
  Bottom 0.254: 42.28,40.27 IC1.72
  Bottom 0.406: v39.69,40.96 41.59,40.96 42.28,40.27
SWO  (via drill 0.4)
  Top 0.406: v28.26,41.27 30.48,39.05 33.34,39.05 v34.61,37.78
  Bottom 0.254: IC1.89 41.77,30.61 41.59,30.8
  Bottom 0.406: 41.59,30.8 v34.61,37.78 | v28.26,41.27 X1.13
TXD0  (via drill 0.4)
  Top 0.254: IC4.22 15.76,33.22
  Top 0.406: 15.76,33.22 21.59,39.05 v21.91,39.05
  Bottom 0.406: v21.91,39.05 21.97,39.12 IC1.51
TXD1  (via drill 0.4)
  Top 0.254: IC4.23 15.26,33.67
  Top 0.406: 15.26,33.67 v21.91,40.32
  Bottom 0.254: 32.28,40.11 IC1.52
  Bottom 0.406: v21.91,40.32 32.07,40.32 32.28,40.11
TXEN  (via drill 0.4)
  Top 0.254: IC4.21 16.26,32.45
  Top 0.406: 16.26,32.45 v19.92,36.12
  Bottom 0.254: 28.81,36.12 IC1.48
  Bottom 0.406: 28.81,36.12 v19.92,36.12
UART1_RX  (via drill 0.4)
  Top 0.406: U$1.PC10 33.34,18.73 35.56,20.95 45.4,20.95 46.35,21.91 46.35,30 48.58,32.23 48.58,38.1 44.77,41.91 42.7,41.91 v41.12,40.32
  Bottom 0.254: IC1.69 40.78,39.99 v41.12,40.32
UART1_TX  (via drill 0.4)
  Top 0.406: v48.26,28.57 48.26,21.27 46.67,19.68 37.15,19.68 U$1.PC11
  Bottom 0.254: IC1.92 47.72,29.11 v48.26,28.57
UART3_RX  (via drill 0.4)
  Top 0.406: X1.5 17.14,42.23 29.84,42.23 31.75,40.32 v34.61,40.32
  Bottom 0.254: 34.29,40.01 34.28,40 IC1.56
  Bottom 0.406: v34.61,40.32 34.29,40.01
UART3_TX
  Bottom 0.254: IC1.55 33.78,40.77 34.29,41.27
  Bottom 0.406: 34.29,41.27 34.29,42.23 33.66,42.86 31.75,42.86 X1.17
UART6_RX  (via drill 0.4)
  Top 0.406: v26.99,35.24 28.57,36.83 v38.1,36.83
  Bottom 0.254: 38.28,37.01 IC1.64
  Bottom 0.406: U$1.STLINK_RX 6.67,24.77 5.08,24.77 4.45,25.4 4.45,32.7 6.99,35.24 v26.99,35.24 | v38.1,36.83 38.28,37.01

### Text on the board
tPlace: Postmaster 1.3
tNames: TX | RX